# EAGLE schematic Office Clock (EAGLE 8.4.3)
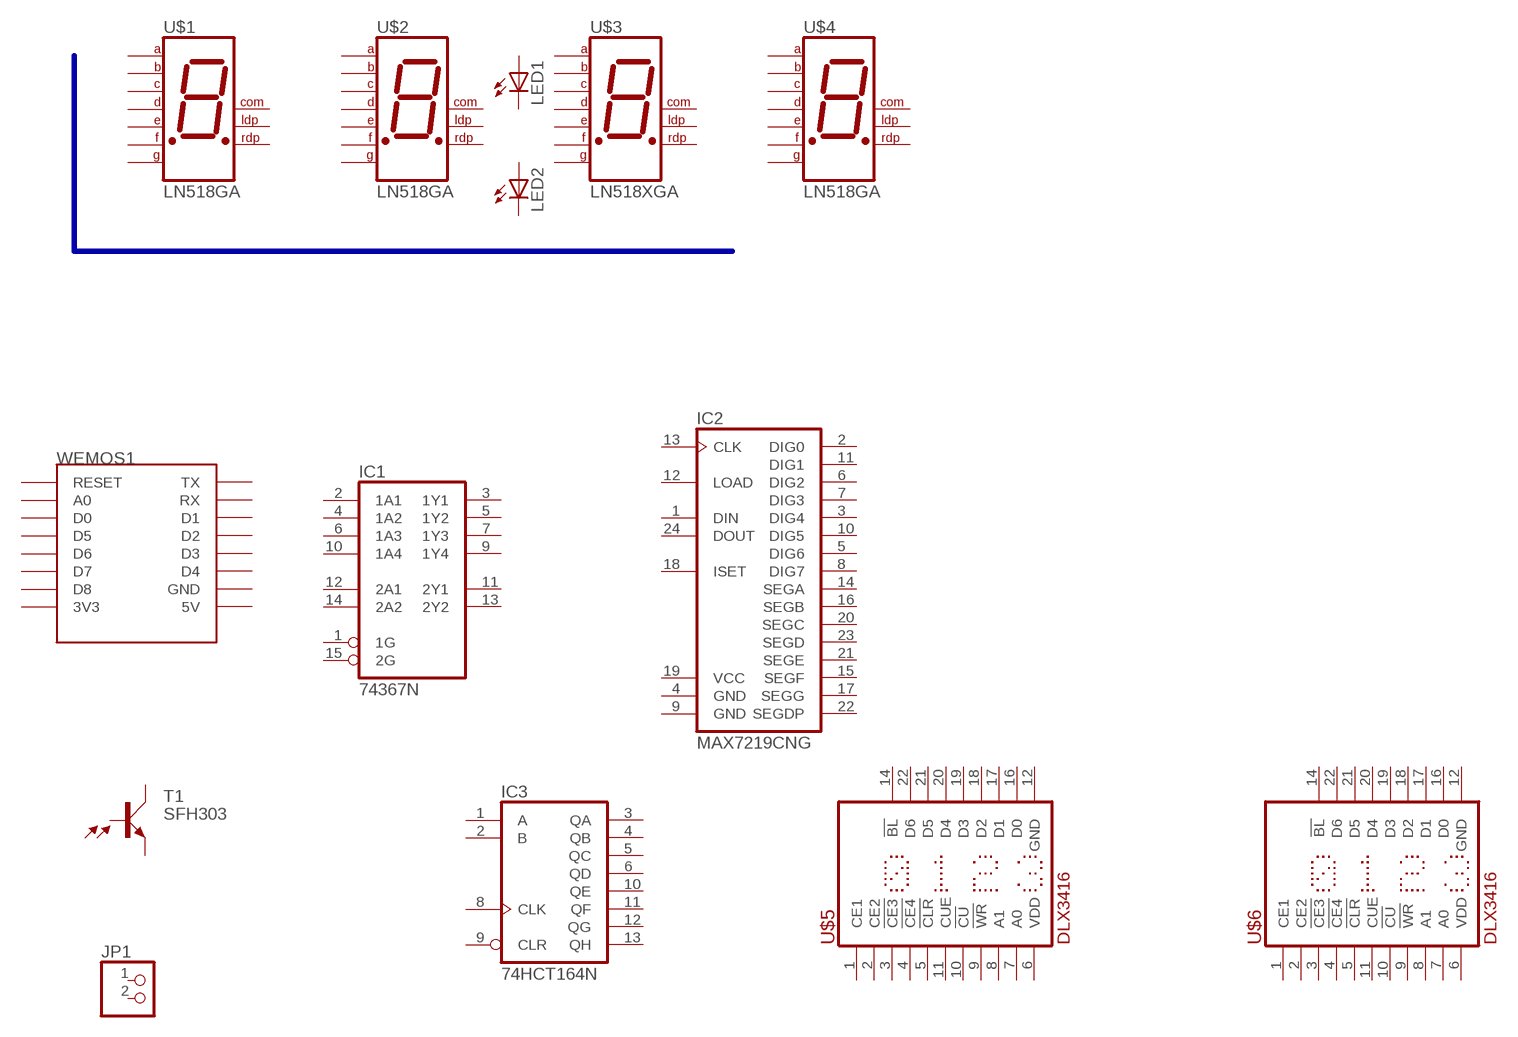
[diagram p0: schematic, sheet 1]

## Parts
IC1  74367N  [DIL16]
IC2  MAX7219CNG  [DIL24-3]
IC3  74HCT164N  [DIL14]
JP1  PINHD-1X2  [1X02]
LED1  LED3MM  [LED3MM]
LED2  LED3MM  [LED3MM]
T1  SFH303  [SFH303]
U$1  LN518GA  LN518XX  [LN518XX]
U$2  LN518GA  LN518XX  [LN518XX]
U$3  LN518XGA  LN518XX  [LN518XX]
U$4  LN518GA  LN518XX  [LN518XX]
U$5  DLX3416  [DLX3416]
U$6  DLX3416  [DLX3416]
WEMOS1  WEMOS-D1-MINI  [WEMOS-D1-MINI]
Unconnected: IC1.1(1G) IC1.2(1A1) IC1.3(1Y1) IC1.4(1A2) IC1.5(1Y2) IC1.6(1A3) IC1.7(1Y3) IC1.9(1Y4) IC1.10(1A4) IC1.11(2Y1) IC1.12(2A1) IC1.13(2Y2) IC1.14(2A2) IC1.15(2G) IC2.1(DIN) IC2.2(DIG0) IC2.3(DIG4) IC2.5(DIG6) IC2.6(DIG2) IC2.7(DIG3) IC2.8(DIG7) IC2.10(DIG5) IC2.11(DIG1) IC2.12(LOAD) IC2.13(CLK) IC2.14(SEGA) IC2.15(SEGF) IC2.16(SEGB) IC2.17(SEGG) IC2.18(ISET) IC2.20(SEGC) IC2.21(SEGE) IC2.22(SEGDP) IC2.23(SEGD) IC2.24(DOUT) IC3.1(A) IC3.2(B) IC3.3(QA) IC3.4(QB) IC3.5(QC) IC3.6(QD) IC3.8(CLK) IC3.9(CLR) IC3.10(QE) IC3.11(QF) IC3.12(QG) IC3.13(QH) JP1.1 JP1.2 LED1.A LED1.K(C) LED2.A LED2.K(C) T1.1(E) T1.2(C) T1.3(B) U$1.1(A) U$1.2(F) U$1.3(COM) U$1.4(E) U$1.5(COM) U$1.6(LDP) U$1.7(COM) U$1.8(RDP) U$1.9(D) U$1.10(COM) U$1.11(C) U$1.12(G) U$1.13(B) U$1.14(COM) U$2.1(A) U$2.2(F) U$2.3(COM) U$2.4(E) U$2.5(COM) U$2.6(LDP) U$2.7(COM) U$2.8(RDP) U$2.9(D) U$2.10(COM) U$2.11(C) U$2.12(G) U$2.13(B) U$2.14(COM) U$3.1(A) U$3.2(F) U$3.3(COM) U$3.4(E) U$3.5(COM) U$3.6(LDP) U$3.7(COM) U$3.8(RDP) U$3.9(D) U$3.10(COM) U$3.11(C) U$3.12(G) U$3.13(B) U$3.14(COM) U$4.1(A) U$4.2(F) U$4.3(COM) U$4.4(E) U$4.5(COM) U$4.6(LDP) U$4.7(COM) U$4.8(RDP) U$4.9(D) U$4.10(COM) U$4.11(C) U$4.12(G) U$4.13(B) U$4.14(COM) U$5.1(CE1) U$5.2(CE2) U$5.3(!CE3) U$5.4(!CE4) U$5.5(!CLR) U$5.7(A0) U$5.8(A1) U$5.9(!WR) U$5.10(!CU) U$5.11(CUE) U$5.14(!BL) U$5.16(D0) U$5.17(D1) U$5.18(D2) U$5.19(D3) U$5.20(D4) U$5.21(D5) U$5.22(D6) U$6.1(CE1) U$6.2(CE2) U$6.3(!CE3) U$6.4(!CE4) U$6.5(!CLR) U$6.7(A0) U$6.8(A1) U$6.9(!WR) U$6.10(!CU) U$6.11(CUE) U$6.14(!BL) U$6.16(D0) U$6.17(D1) U$6.18(D2) U$6.19(D3) U$6.20(D4) U$6.21(D5) U$6.22(D6) WEMOS1.3V3 WEMOS1.5V WEMOS1.A0 WEMOS1.D0 WEMOS1.D1 WEMOS1.D2 WEMOS1.D3 WEMOS1.D4 WEMOS1.D5 WEMOS1.D6 WEMOS1.D7 WEMOS1.D8 WEMOS1.GND WEMOS1.RESET WEMOS1.RX WEMOS1.TX

## Buses
SEGMENT[0..7]

## Power pins joined to a net without a drawn wire
GND: IC1.8(GND) IC2.4(GND) IC2.9(GND) IC3.7(GND) U$5.12(GND) U$6.12(GND)
VCC: IC1.16(VCC) IC2.19(VCC) IC3.14(VCC)
VDD: U$5.6(VDD) U$6.6(VDD)

## Library data of the parts
IC1 = 74xx-us:74*367: Hex BUS DRIVER, 3-state
IC2 = maxim:MAX7219CNG: LED DISPLAY DRIVER; MF: MAXIM; MPN: MAX7219CNG; OC_FARNELL: 1523914; OC_NEWARK: 34C4018
IC3 = 74xx-us:74*164: 8-bit parallel out SHIFT REGISTER
JP1 = pinhead:PINHD-1X2: PIN HEADER
LED1 LED2 = led:LED: LED OSRAM: - CHIPLED LG R971, LG N971, LY N971, LG Q971, LY Q971, LO R971, LY R971 LH N974, LH R974 LS Q976, LO Q976, LY Q976 LO Q996 - Hyper CHIPLED LW Q18S LB Q993, LB Q99A, LB R99A - SideLED LS A670, LO A670, LY A670, LG A670, LP A670 LB A673, LV A673, LT A673, LW A673 LH A674 LY A675 LS A676, LA A676, LO A676, LY A676, LW A676 LS A679, LY A679, LG A679 - Hyper Micro SIDELED® LS Y876, LA Y876, LO Y876, LY Y876 LT Y87S - SmartLED LW L88C, LW L88S LB L89C, LB L89S, LG L890 LS L89K, LO L89K, LY L89K LS L896, LA L896, LO L896, LY L896 - TOPLED LS T670, LO T670, LY T670, LG T670, LP T670 LSG T670, LSP T670, LSY T670, LOP T670, LYG T670 LG T671, LOG T671, LSG T671 LB T673, LV T673, LT T673, LW T673 LH T674 LS T676, LA T676, LO T676, LY T676, LB T676, LH T676, LSB T676, LW T676 LB T67C, LV T67C, LT T67C, LS T67K, LO T67K, LY T67K, LW E67C LS E67B, LA E67B, LO E67B, LY E67B, LB E67C, LV E67C, LT E67C LW T67C LS T679, LY T679, LG T679 LS T770, LO T770, LY T770, LG T770, LP T770 LB T773, LV T773, LT T773, LW T773 LH T774 LS E675, LA E675, LY E675, LS T675 LS T776, LA T776, LO T776, LY T776, LB T776 LHGB T686 LT T68C, LB T68C - Hyper Mini TOPLED® LB M676 - Mini TOPLED Santana® LG M470 LS M47K, LO M47K, LY M47K Source: http://www.osram.convergy.de LUXEON: - LUMILED® LXK2-PW12-R00, LXK2-PW12-S00, LXK2-PW14-U00, LXK2-PW14-V00 LXK2-PM12-R00, LXK2-PM12-S00, LXK2-PM14-U00 LXK2-PE12-Q00, LXK2-PE12-R00, LXK2-PE12-S00, LXK2-PE14-T00, LXK2-PE14-U00 LXK2-PB12-K00, LXK2-PB12-L00, LXK2-PB12-M00, LXK2-PB14-N00, LXK2-PB14-P00, LXK2-PB14-Q00 LXK2-PR12-L00, LXK2-PR12-M00, LXK2-PR14-Q00, LXK2-PR14-R00 LXK2-PD12-Q00, LXK2-PD12-R00, LXK2-PD12-S00 LXK2-PH12-R00, LXK2-PH12-S00 LXK2-PL12-P00, LXK2-PL12-Q00, LXK2-PL12-R00 Source: www.luxeon.com KINGBRIGHT: KA-3528ASYC Source: www.kingbright.com
T1 = opto-trans-siemens:SFH303: Silicium NPN Phototransistor Source: Siemens; OC_FARNELL: unknown; OC_NEWARK: unknown
U$1-U$4 = MyDisplays:LN518XX
U$5 U$6 = DLX3416:DLX3416
WEMOS1 = esp8266modules:WEMOS-D1-MINI: WeMos.cc D1 mini ESP8266 module